# Altium schematic sheet CurrentMeasure_ADCVoltage.SchDoc
size A; SheetNumber: 5; SheetTotal: 5
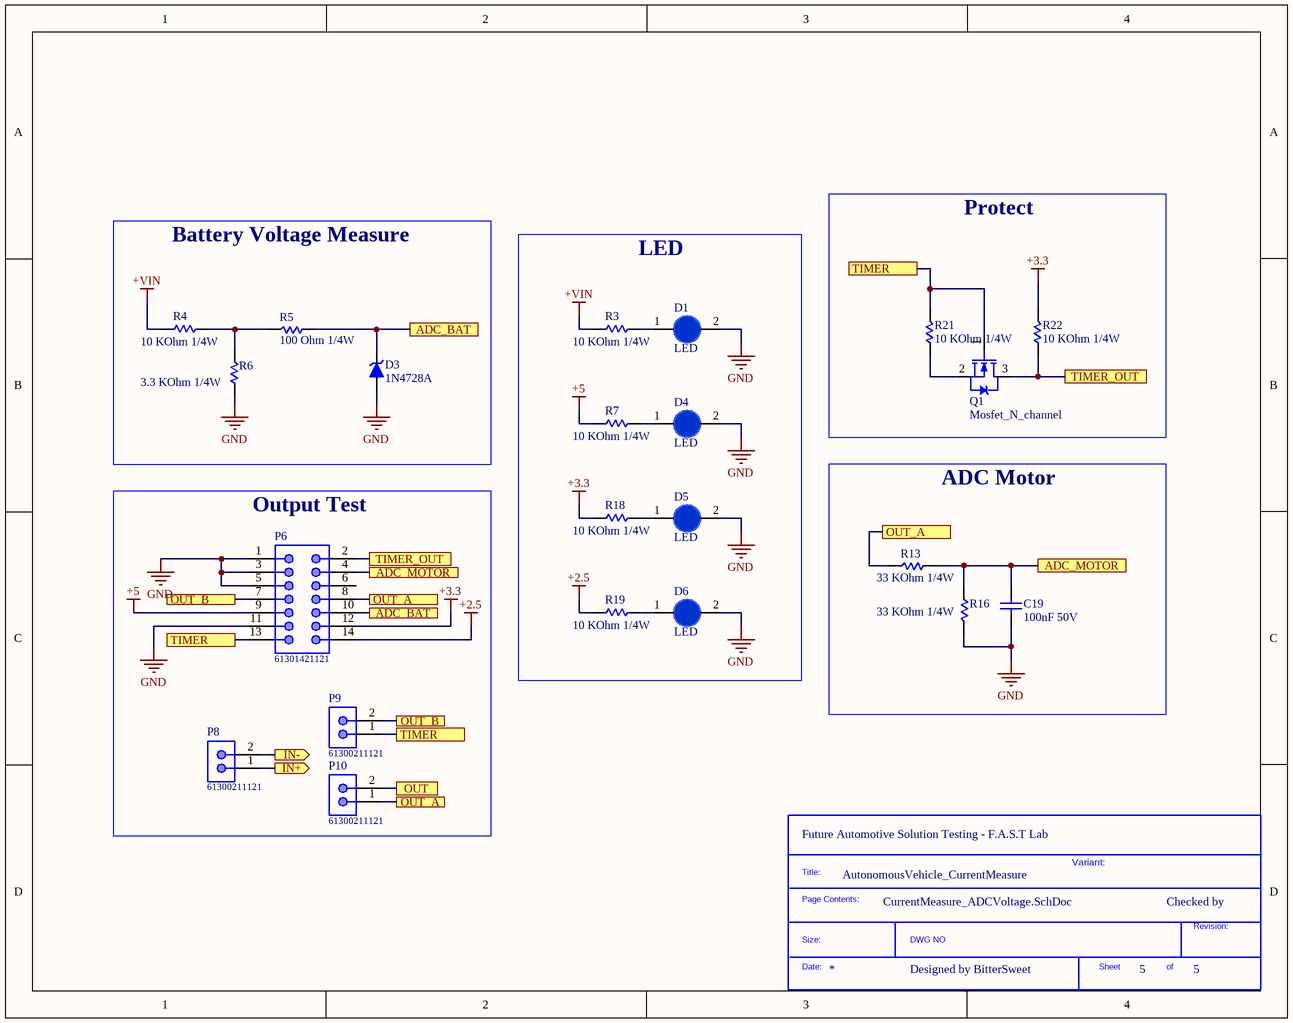
[diagram p0: CurrentMeasure_ADCVoltage.SchDoc]

## Parts
*?  SDTitleBlock  (value not drawn)  (graphical)
C19  100nF 50V  [CAP_RADIAL_2.54]
D1  LED  [DIP_LED_3MM]
D3  1N4728A  [1N4728A_HoleDO-41]
D4  LED  [DIP_LED_3MM]
D5  LED  [DIP_LED_3MM]
D6  LED  [DIP_LED_3MM]
P6  61301421121  [61301421121]
P8  61300211121  [61300211121]
P9  61300211121  [61300211121]
P10  61300211121  [61300211121]
Q1  Mosfet_N_channel  [TO-92]
R3  10 KOhm 1/4W  [RESISTOR-1/4W]
R4  10 KOhm 1/4W  [RESISTOR-1/4W]
R5  100 Ohm 1/4W  [RESISTOR-1/4W]
R6  3.3 KOhm 1/4W  [RESISTOR-1/4W]
R7  10 KOhm 1/4W  [RESISTOR-1/4W]
R13  33 KOhm 1/4W  [RESISTOR-1/4W]
R16  33 KOhm 1/4W  [RESISTOR-1/4W]
R18  10 KOhm 1/4W  [RESISTOR-1/4W]
R19  10 KOhm 1/4W  [RESISTOR-1/4W]
R21  10 KOhm 1/4W  [RESISTOR-1/4W]
R22  10 KOhm 1/4W  [RESISTOR-1/4W]

## Blocks framed on the sheet
Battery Voltage Measure: D3 R4-R6
Protect: Q1 R21 R22
LED: D1 D4-D6 R3 R7 R18 R19
Output Test: P6 P8-P10
ADC Motor: C19 R13 R16

## Ports
ADC_BAT, ADC_MOTOR, IN+ (out), IN- (out), OUT, OUT_A, OUT_B, TIMER, TIMER_OUT

## Nets
+2.5: P6.14 R19.1
+3.3: P6.12 R18.1 R22.2
+5: P6.9 R7.1
+VIN: R3.1 R4.1
GND: C19.2 D1.2(K) D3.1(A) D4.2(K) D5.2(K) D6.2(K) P6.1 P6.3 P6.5 P6.11 R6.1 R16.2
ADC_BAT: D3.2(K) P6.10 R5.1 ; port ADC_BAT
ADC_MOTOR: C19.1 P6.4 R13.1 R16.1 ; port ADC_MOTOR
IN+: P8.1 ; port IN+
IN-: P8.2 ; port IN-
OUT: P10.2 ; port OUT
OUT_A: P6.8 P10.1 R13.2 ; port OUT_A
OUT_B: P6.7 P9.2 ; port OUT_B
TIMER: P6.13 P9.1 Q1.1(G) R21.2 ; port TIMER
TIMER_OUT: P6.2 Q1.3(D) R22.1 ; port TIMER_OUT
NetD1_1: D1.1(A) R3.2
NetD4_1: D4.1(A) R7.2
NetD5_1: D5.1(A) R18.2
NetD6_1: D6.1(A) R19.2
NetQ1_2: Q1.2(S) R21.1
NetR4_2: R4.2 R5.2 R6.2

Not connected (* = marked no-connect by the designer): P6 6

## Notes on the sheet
- (near *?) Future Automotive Solution Testing - F.A.S.T Lab
- AutonomousVehicle_CurrentMeasure
- Variant:
- Checked by
- Designed by BitterSweet
- (in symbol SDTitleBlock) Title:; Page Contents:; Revision:; Size:; DWG NO; Date:; Sheet; of

## Library data of the parts
C19 = Capacitor: Capacitor 100nF 50V; URL: https://www.thegioiic.com/tu-gom-tron-100nf-0-1uf-50v
D1 D4-D6 = LED: DIP LED Blue; URL: https://www.thegioiic.com/led-xanh-duong-3mm-chan-dai
D3 = Diode_Zener: 1N4728A Diode Zener 3.3V 1W  DO-41; URL: https://www.thegioiic.com/1n4728-diode-zener-3-3v-1w
P6 = 61301421121: WR-PHD Pin Header, THT, pitch 2.54mm, Dual Row, Vertical, 14p; Manufacturer: Wurth Elektronik; Pin Number: 14; Rated Current: 3A; Working Voltage: 250VAC; Withstanding Voltage: 500VAC; Contact Resistance: 20mOhm; Supply name 1: Mouser; ComponentLink1Description: Manufacturer; ComponentLink1URL: http://www.we-online.de; ComponentLink2Description: Datasheet; ComponentLink2URL: https://www.we-online.com/catalog/datasheet/61301421121.pdf; Manufacturer Part Number: 61301421121; Published Date: May 2020; Pitch: 2.54mm; Operating Temperature: -40 to +105degC; Mounting Technology: THT; Packaging: Bag; Gender: Pin Header; Row Number: Dual; Orientation: Vertical; ComponentLink3Description: Global Supply; ComponentLink3URL: https://www.we-online.com/en/components/products/PHD_2_54_THT_DUAL_PIN_HEADER_6130XX21121?sq=61301421121#61301421121; ComponentLink4Description: Global Supply; ComponentLink4URL: https://www.mouser.vn/ProductDetail/Wurth-Elektronik/61301421121?qs=PhR8RmCirEb6oOcq3uED2w%3D%3D; Supplier 1 Name: Mouser; Supplier 1 SN: 710-61301421121; Supplier 1 URL: https://www.mouser.vn/ProductDetail/Wurth-Elektronik/61301421121?qs=PhR8RmCirEb6oOcq3uED2w%3D%3D; Supplier 2 Name: Digi-Key; Supplier 2 SN: N/A; Supplier 2 URL: N/A; Supplier 3 Name: thegioiic; Supplier 3 SN: N/A; Supplier 3 URL: N/A
P8-P10 = 61300211121: WR-PHD Pin Header, THT, pitch 2.54mm, Single Row, Vertical, 2p; Manufacturer: Wurth Elektronik; Pin Number: 2; Rated Current: 3A; Working Voltage: 250VAC; Withstanding Voltage: 500VAC; Contact Resistance: 20mOhm; Supply Name 1: Mouser; ComponentLink1Description: Manufacturer; ComponentLink1URL: http://www.we-online.de; ComponentLink2Description: Datasheet; ComponentLink2URL: https://www.we-online.com/catalog/datasheet/61300211121.pdf; Manufacturer Part Number: 61300211121; Published Date: May 2020; Pitch: 2.54mm; Operating Temperature: -40 to +105degC; Mounting Technology: THT; Packaging: Bag; Gender: Pin Header; Row Number: Single; Orientation: Vertical; ComponentLink3Description: Global Supply; ComponentLink3URL: https://www.mouser.vn/ProductDetail/Wurth-Elektronik/61300211121?qs=t4813l51qx%252B1A5GYDQxPlw%3D%3D; Supplier 1 Name: Mouser; Supplier 1 SN: 710-61300211121; Supplier 1 URL: https://www.mouser.vn/ProductDetail/Wurth-Elektronik/61300211121?qs=t4813l51qx%252B1A5GYDQxPlw%3D%3D; Supplier 2 Name: Digi-Key; Supplier 2 SN: N/A; Supplier 2 URL: N/A; Supplier 3 Name: thegioiic; Supplier 3 SN: N/A; Supplier 3 URL: N/A
R3-R7 R13 R16 R18 R19 R21 R22 = RESISTOR: MP: NUCLEO-F401RE; Availability: Unavailable; Price: None; Package: None; Value: *
  R3 R4 R7 R18 R19 R21 R22: URL: https://www.thegioiic.com/dien-tro-10-kohm-1-4w-1-5-vong-mau
  R5: URL: https://www.thegioiic.com/dien-tro-100-ohm-1-4w-1-5-vong-mau
  R6: URL: https://www.thegioiic.com/dien-tro-3-3-kohm-1-4w-1-5-vong-mau
  R13 R16: URL: https://www.thegioiic.com/dien-tro-33-kohm-1-4w-1-5-vong-mau